# Altium schematic sheet Zynq Config - JTAG - Debug.SchDoc: Zynq (Config, JTAG, Debug)
size A2; DocumentNumber: 3; Revision: A; SheetNumber: 3; SheetTotal: 10
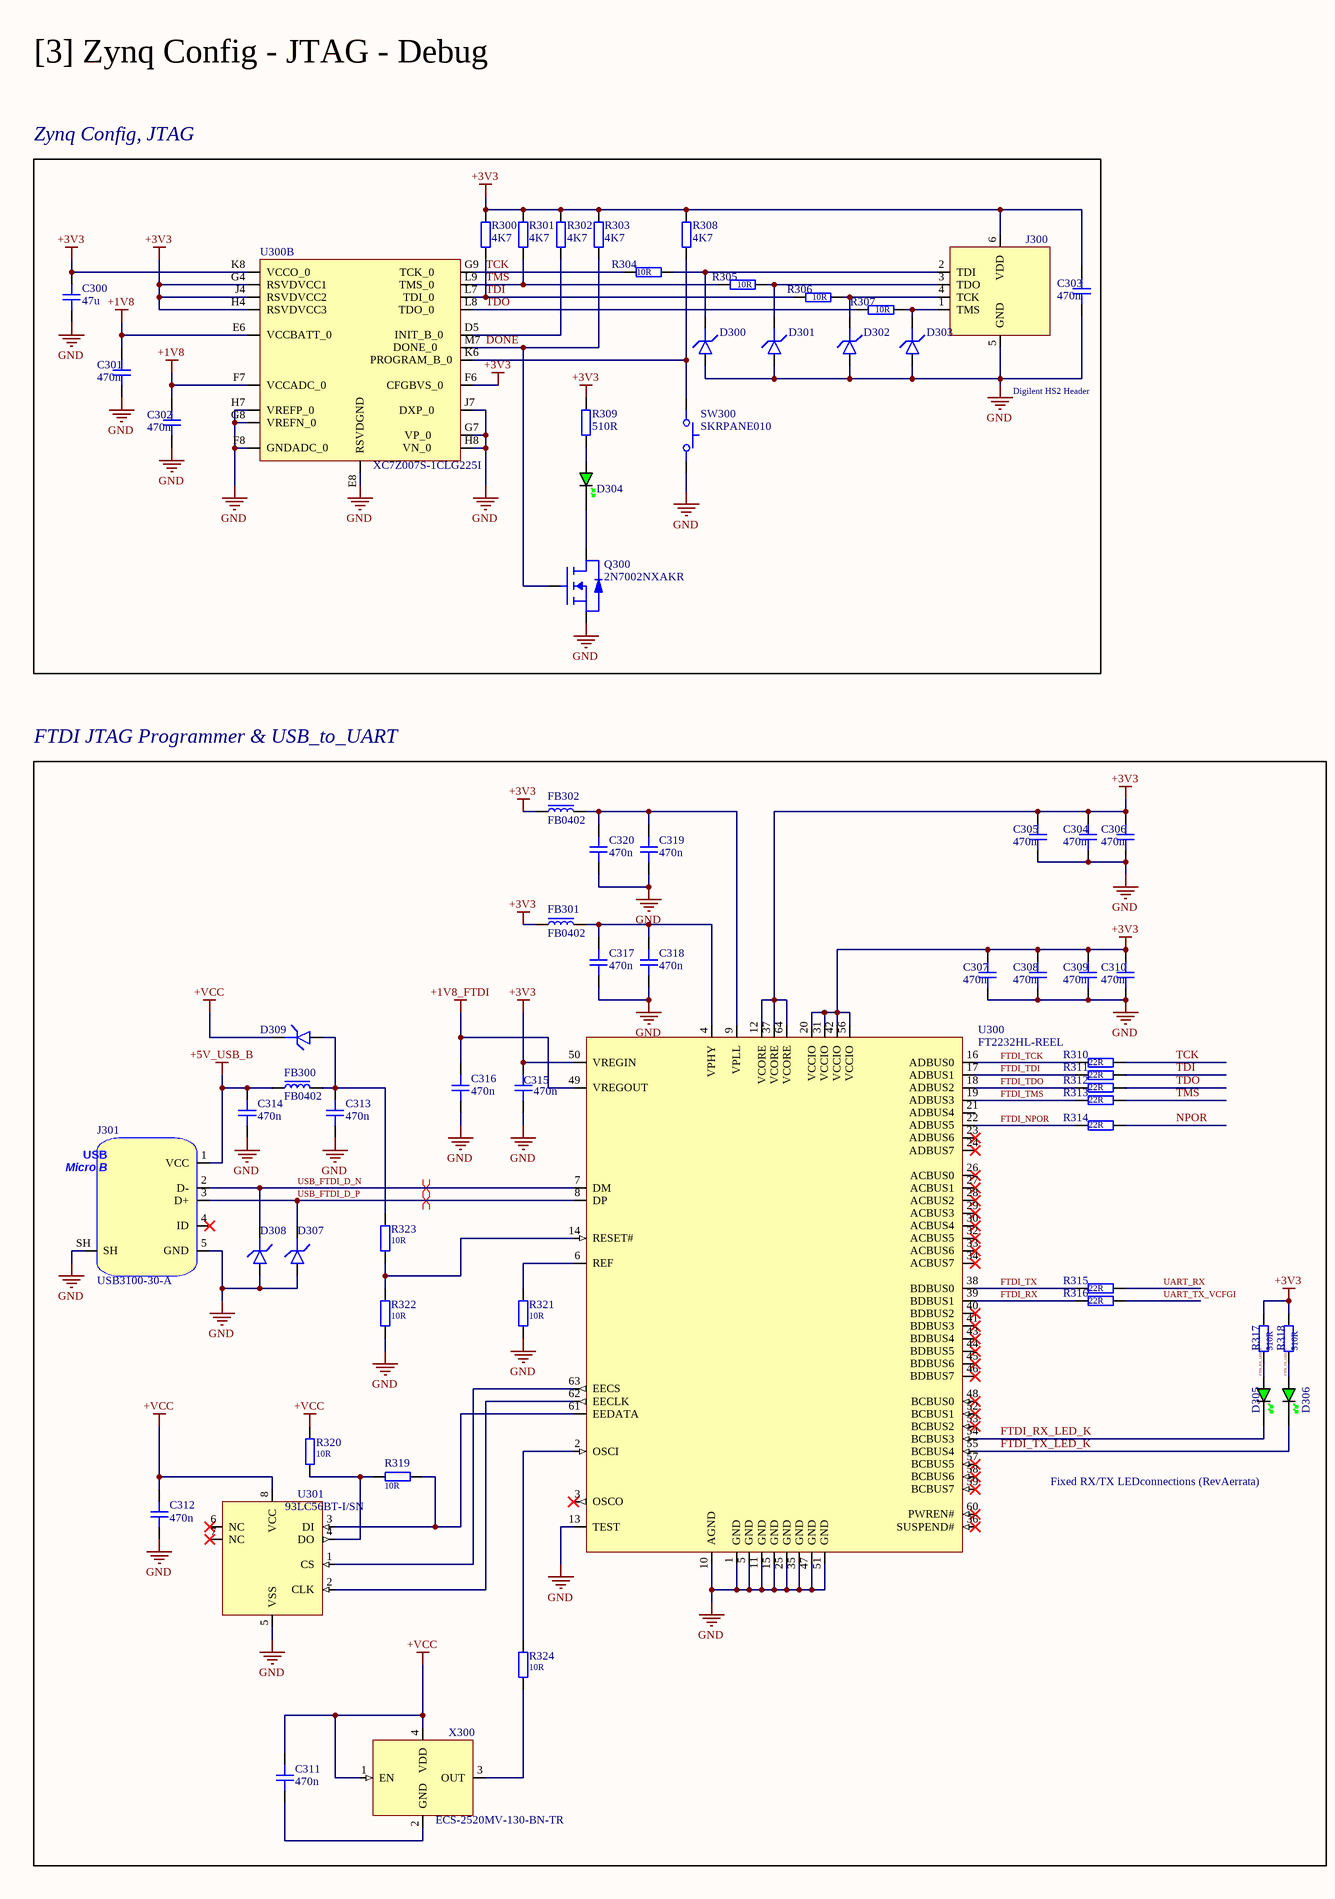
[diagram p0: Zynq Config - JTAG - Debug.SchDoc, left]
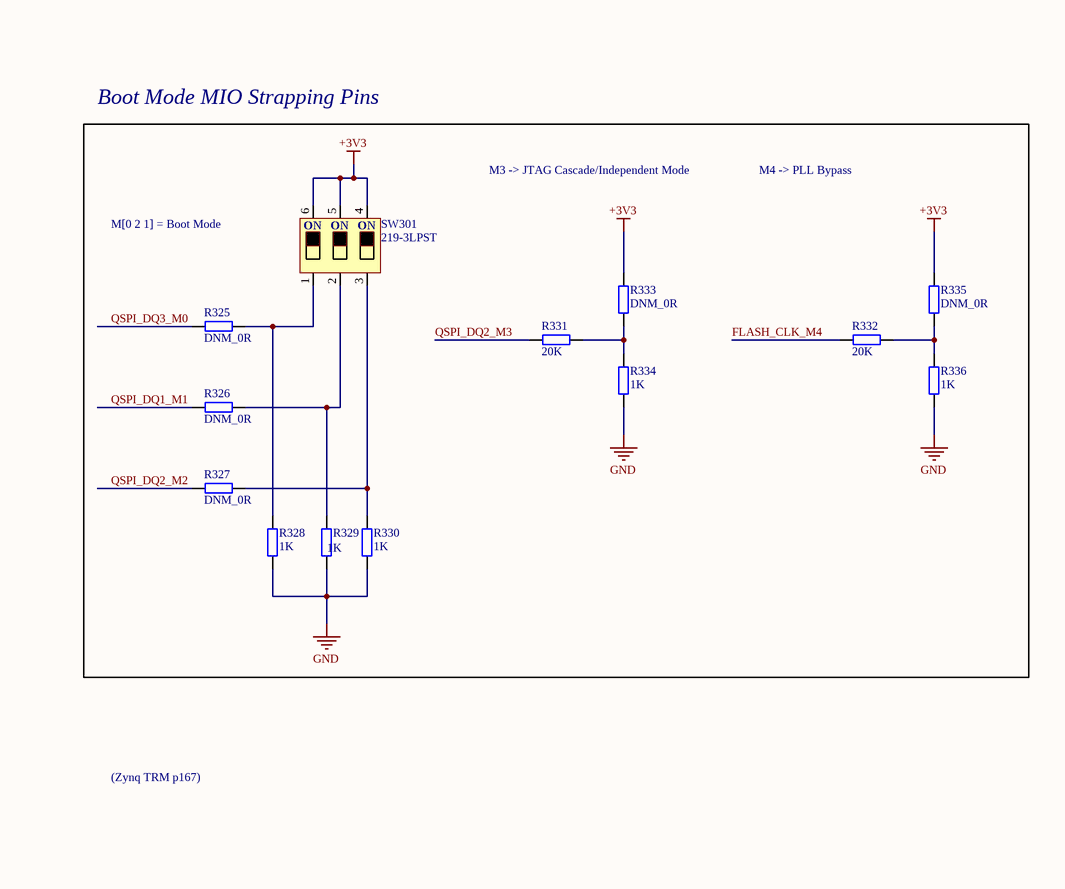
[diagram p1: Zynq Config - JTAG - Debug.SchDoc, right]

## Parts
(Parts that share a designator on the sheet are numbered #1, #2 ... from top to bottom, then left to right.)
C300  47u  [CAP_1210]
C301  470n  [CAP_1210]
C302  470n  [CAP_1210]
C303  470n  [CAP_1210]
C304  470n  [CAP_1210]
C305  470n  [CAP_1210]
C306  470n  [CAP_1210]
C307  470n  [CAP_1210]
C308  470n  [CAP_1210]
C309  470n  [CAP_1210]
C310  470n  [CAP_1210]
C311  470n  [CAP_1210]
C312  470n  [CAP_1210]
C313  470n  [CAP_1210]
C314  470n  [CAP_1210]
C315  470n  [CAP_1210]
C316  470n  [CAP_1210]
C317  470n  [CAP_1210]
C318  470n  [CAP_1210]
C319  470n  [CAP_1210]
C320  470n  [CAP_1210]
D300  D_TVS_0402  [D_0402]  (value not drawn)
D301  D_TVS_0402  [D_0402]  (value not drawn)
D302  D_TVS_0402  [D_0402]  (value not drawn)
D303  D_TVS_0402  [D_0402]  (value not drawn)
D304  GREEN  [LED_0402_GREEN]  (value not drawn)
D305  GREEN  [LED_0402_GREEN]  (value not drawn)
D306  GREEN  [LED_0402_GREEN]  (value not drawn)
D307  D_TVS_0402  [D_0402]  (value not drawn)
D308  D_TVS_0402  [D_0402]  (value not drawn)
D309  D_TVS_0402  [D_0402]  (value not drawn)
FB300  FB0402  [FB_0402]
FB301  FB0402  [FB_0402]
FB302  FB0402  [FB_0402]
J300  Digilent HS2 Header  [DIGILENT_HS2]
J301  USB3100-30-A  [USB3100-30-A]
Q300  2N7002NXAKR  [SSM3J338R,LF-SOT23-F]
R300  4K7  [RES_0402]
R301  4K7  [RES_0402]
R302  4K7  [RES_0402]
R303  4K7  [RES_0402]
R304  10R  [RES_0402]
R305  10R  [RES_0402]
R306  10R  [RES_0402]
R307  10R  [RES_0402]
R308  4K7  [RES_0402]
R309  510R  [RES_0402]
R310  22R  [RES_0402]
R311  22R  [RES_0402]
R312  22R  [RES_0402]
R313  22R  [RES_0402]
R314  22R  [RES_0402]
R315  22R  [RES_0402]
R316  22R  [RES_0402]
R317  510R  [RES_0402]
R318  510R  [RES_0402]
R319  10R  [RES_0402]
R320  10R  [RES_0402]
R321  10R  [RES_0402]
R322  10R  [RES_0402]
R323  10R  [RES_0402]
R324  10R  [RES_0402]
R325  DNM_0R  [RES_0402]
R326  DNM_0R  [RES_0402]
R327  DNM_0R  [RES_0402]
R328  1K  [RES_0402]
R329  1K  [RES_0402]
R330  1K  [RES_0402]
R331  20K  [RES_0402]
R332  20K  [RES_0402]
R333  DNM_0R  [RES_0402]
R334  1K  [RES_0402]
R335  DNM_0R  [RES_0402]
R336  1K  [RES_0402]
SW300  SKRPANE010  [SKRPANE010]
SW301  219-3LPST  [219-3LPST]
U300#1  XC7Z007S-1CLG225I  [CLG225]  (part B of 7)
U300#2  FT2232HL-REEL  [LQFP-64-0.5mm]
U301  93LC56BT-I/SN  [SOIC-8]
X300  ECS-2520MV-130-BN-TR  [XTAL_2520]

## Blocks framed on the sheet
Zynq Config, JTAG: C300-C303 D300-D304 J300 Q300 R300-R309 SW300 U300#1
Boot Mode MIO Strapping Pins: R325-R336 SW301
FTDI JTAG Programmer & USB_to_UART: C304-C320 D305-D309 FB300-FB302 J301 R310-R324 U300#2 U301 X300

## Nets
+1V8: C301.2 C302.2 U300#1.E6(VCCBATT_0) U300#1.F7(VCCADC_0)
+1V8_FTDI: C316.2 U300#2.49(VREGOUT)
+3V3: C300.2 C303.2 C304.2 C305.2 C306.2 C307.2 C308.2 C309.2 C310.2 C315.2 FB301.1 FB302.1 J300.6(VDD) R300.2 R301.2 R302.2 R303.2 R308.2 R309.1 R317.1 R318.1 R333.1 R335.1 SW301.4 SW301.5 SW301.6 U300#1.F6(CFGBVS_0) U300#1.G4(RSVDVCC1) U300#1.H4(RSVDVCC3) U300#1.J4(RSVDVCC2) U300#1.K8(VCCO_0) U300#2.12(VCORE) U300#2.20(VCCIO) U300#2.31(VCCIO) U300#2.37(VCORE) U300#2.42(VCCIO) U300#2.50(VREGIN) U300#2.56(VCCIO) U300#2.64(VCORE)
+5V_USB_B: C314.2 FB300.1 J301.1(VCC)
+VCC: C311.2 C312.2 D309.K R320.1 U301.8(VCC) X300.1(EN) X300.4(VDD)
GND: C300.1 C301.1 C302.1 C303.1 C304.1 C305.1 C306.1 C307.1 C308.1 C309.1 C310.1 C312.1 C313.1 C314.1 C315.1 C316.1 C317.1 C318.1 C319.1 C320.1 D300.A D301.A D302.A D303.A D307.A D308.A J300.5(GND) J301.5(GND) J301.SH Q300.S R321.2 R322.2 R328.2 R329.1 R330.1 R334.2 R336.2 SW300.34 U300#1.E8(RSVDGND) U300#1.F8(GNDADC_0) U300#1.G7(VP_0) U300#1.G8(VREFN_0) U300#1.H7(VREFP_0) U300#1.H8(VN_0) U300#1.J7(DXP_0) U300#2.1(GND) U300#2.5(GND) U300#2.10(AGND) U300#2.11(GND) U300#2.13(TEST) U300#2.15(GND) U300#2.25(GND) U300#2.35(GND) U300#2.47(GND) U300#2.51(GND) U301.5(VSS)
DONE: Q300.G R303.1 U300#1.M7(DONE_0)
FLASH_CLK_M4: R332.2
FTDI_NPOR: R314.2 U300#2.22(ADBUS5)
FTDI_RX: R316.2 U300#2.39(BDBUS1)
FTDI_RX_LED_A: D305.A R317.2
FTDI_RX_LED_K: D305.K U300#2.54(BCBUS3)
FTDI_TCK: R310.2 U300#2.16(ADBUS0)
FTDI_TDI: R311.2 U300#2.17(ADBUS1)
FTDI_TDO: R312.2 U300#2.18(ADBUS2)
FTDI_TMS: R313.2 U300#2.19(ADBUS3)
FTDI_TX: R315.2 U300#2.38(BDBUS0)
FTDI_TX_LED_A: D306.A R318.2
FTDI_TX_LED_K: D306.K U300#2.55(BCBUS4)
NPOR: R314.1
QSPI_DQ1_M1: R326.2
QSPI_DQ2_M2: R327.2
QSPI_DQ2_M3: R331.2
QSPI_DQ3_M0: R325.2
TCK: R300.1 R301.1 R304.2 R305.2 R306.2 R310.1 R311.1 R313.1 U300#1.G9(TCK_0) U300#1.L7(TDI_0) U300#1.L9(TMS_0)  [also labelled TDI, TMS]
TDO: R307.2 R312.1 U300#1.L8(TDO_0)
UART_RX: R315.1
UART_TX_VCFGI: R316.1
USB_FTDI_D_N: D308.K J301.2(D-) U300#2.7(DM)
USB_FTDI_D_P: D307.K J301.3(D+) U300#2.8(DP)
NetC311_1: C311.1 X300.2(GND)
NetC313_2: C313.2 D309.A FB300.2 R323.1
NetC317_2: C317.2 C318.2 FB301.2 U300#2.4(VPHY)
NetC319_2: C319.2 C320.2 FB302.2 U300#2.9(VPLL)
NetD300_K: D300.K J300.2(TDI) R304.1
NetD301_K: D301.K J300.3(TDO) R305.1
NetD302_K: D302.K J300.4(TCK) R306.1
NetD303_K: D303.K J300.1(TMS) R307.1
NetD304_A: D304.A R309.2
NetD304_K: D304.K Q300.D
NetR302_1: R302.1 U300#1.D5(INIT_B_0)
NetR308_1: R308.1 SW300.12 U300#1.K6(PROGRAM_B_0)
NetR319_1: R319.1 R320.2 U301.4(DO)
NetR319_2: R319.2 U300#2.61(EEDATA) U301.3(DI)
NetR321_1: R321.1 U300#2.6(REF)
NetR322_1: R322.1 R323.2 U300#2.14(RESET#)
NetR324_1: R324.1 X300.3(OUT)
NetR324_2: R324.2 U300#2.2(OSCI)
NetR325_1: R325.1 R328.1 SW301.1
NetR326_1: R326.1 R329.2 SW301.2
NetR327_1: R327.1 R330.2 SW301.3
NetR331_1: R331.1 R333.2 R334.1
NetR332_1: R332.1 R335.2 R336.1
NetU300#2_62: U300#2.62(EECLK) U301.2(CLK)
NetU300#2_63: U300#2.63(EECS) U301.1(CS)

Not connected (* = marked no-connect by the designer): J301 4(ID)*; U300#2 3(OSCO)* 21(ADBUS4) 23(ADBUS6)* 24(ADBUS7)* 26(ACBUS0)* 27(ACBUS1)* 28(ACBUS2)* 29(ACBUS3)* 30(ACBUS4)* 32(ACBUS5)* 33(ACBUS6)* 34(ACBUS7)* 36(SUSPEND#)* 40(BDBUS2)* 41(BDBUS3)* 43(BDBUS4)* 44(BDBUS5)* 45(BDBUS6)* 46(BDBUS7)* 48(BCBUS0)* 52(BCBUS1)* 53(BCBUS2)* 57(BCBUS5)* 58(BCBUS6)* 59(BCBUS7)* 60(PWREN#)*; U301 6(NC)* 7(NC)*

## Layout directives
differential pair: USB_FTDI_D_N, USB_FTDI_D_P

## Notes on the sheet
- [3] Zynq Config - JTAG - Debug
- M3 -> JTAG Cascade/Independent Mode
- M4 -> PLL Bypass
- M[0 2 1] = Boot Mode
- (Zynq TRM p167)
- Fixed RX/TX LEDconnections (RevAerrata)
- Title
- Size:
- Date:
- File:
- A2
- Number:
- Time:
- Revision:
- Sheet
- of
- (in symbol 219-3LPST) ON
- (in symbol USB3100-30-A) USB; Micro B

## Library data of the parts
C300-C320 = CAP_1210: Capacitor SMD 1210; Manufacturer: *; Manufacturer Part Number: *; Distributor Link: *; LCSC: *; Rating: *; Dielectric: *
D300-D303 D307-D309 = D_TVS_0402: Diode TVS / ESD 0402
D304-D306 = LED_0402_GREEN: LED 0402 GREEN SMD
FB300-FB302 = FB_0402: Ferrite Bead SMD 0402; Manufacturer: *; Manufacturer Part Number: *; Distributor Link: *; LCSC: *
J300 = Digilent_HS2_Header: Digilent HS2 6-Pin 2.54mm Pitch Header; Manufacturer: Amphenol FCI; Manufacturer Part Number: 68000-406HLF
J301 = USB3100-30-A: USB Connector Type Micro B 2.0 SMD Reverse Mount; Manufacturer: GCT; Manufacturer Part Number: USB3100-30-A
Q300 = 2N7002NXAKR: MOSFET N-Channel Vds=60V Id=300mA with ESD Protection; Manufacturer: Nexperia; Manufacturer Part Number: 2N7002NXAKR
R300-R336 = RES_0402: Resistor SMD 0402; Manufacturer: *; Manufacturer Part Number: *; Distributor Link: *; LCSC: *
SW300 = SKRPANE010: Tactile Switch SMD SPST; Manufacturer: Alps Alpine; Manufacturer Part Number: SKRPANE010
SW301 = 219-3LPST: DIP Switches SPST 3x; Manufacturer: CTS; Manufacturer Part Number: 219-3LPST
U300#1 = XC7Z007S-1CLG225I: Xilinx FPGA SoC Zynq 7-Series XC7Z007S CLG255 Package Industrial Temperature Grade; Manufacturer: Xilinx; Manufacturer Part Number: XC7Z007S-1CLG225I
U300#2 = FT2232HL-REEL: Hi-Speed Dual USB UART/FIFO IC; Manufacturer: FTDI; Manufacturer Part Number: FT2232HL-REEL; Distributor Link: https://www.mouser.de/ProductDetail/FTDI/FT2232HL-REEL?qs=D1%2FPMqvA100v7FHcEx164g%3D%3D; LCSC: C27882
U301 = 93LC56BT-I/SN: 2K Microwire Compatible Serial EEPROM; Manufacturer: Microchip; Manufacturer Part Number: 93LC56BT-I/SN; Distributor Link: https://www.mouser.de/ProductDetail/Microchip-Technology/93LC56BT-I-SN?qs=lQv0JY93vreW%252BBssv4v8RA%3D%3D; LCSC: C6164
X300 = ECS-2520MV-130-BN-TR: Standard Clock Oscillators XO (Standard),13MHz,Standby (Power Down),CMOS, Multi-Volt,1.6 V 3.6 V,+/-50ppm,-40 C 85 C,6mA,Surface Mount,4-SMD, No Lead,(2.50mm x 2.00mm),(0.80mm); Manufacturer: ECS; Manufacturer Part Number: ECS-2520MV-130-BN-TR